# EAGLE design buzzer_breakout (EAGLE 6.5.0)
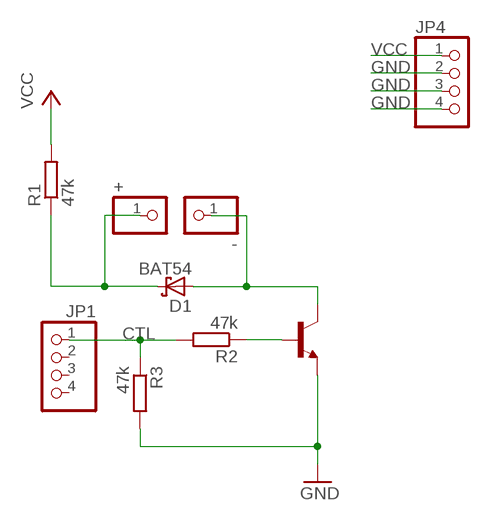
[diagram p0: schematic, sheet 1]

## Parts
+  PINHD-1X1  [1X01]
-  PINHD-1X1  [1X01]
D1  BAT54  [SOT23]
JP1  PINHD-1X4  [1X04]
JP4  PINHD-1X4  [1X04]
R1  47k  R-EU_R0805  [R0805]
R2  47k  R-EU_R0805  [R0805]
R3  47k  R-EU_R0805  [R0805]
T1  BC817-16-NPN-SOT23-BEC  [SOT23-BEC]

## Nets
CTL: JP1.1 R2.2 R3.1
GND: JP4.2 JP4.3 JP4.4 R3.2 T1.E
N$1: +.1 D1.3(C) R1.1
N$2: -.1 D1.1(A) T1.C
N$3: R2.1 T1.B
VCC: JP4.1 R1.2
Unconnected: JP1.2 JP1.3 JP1.4

## Library data of the parts
+ - = pinhead:PINHD-1X1: PIN HEADER
D1 = diode:BAT54: Schottky Diodes Source: Fairchild .. BAT54.pdf
JP1 JP4 = pinhead:PINHD-1X4: PIN HEADER
R1-R3 = resistor:R-EU_: RESISTOR, European symbol
T1 = transistor-neu-to92:*-NPN-: NPN Transistror

## Net classes
0 default: width 0.406 mm
1 Ground: width 0.1 mm, drill 0.2 mm

## Board
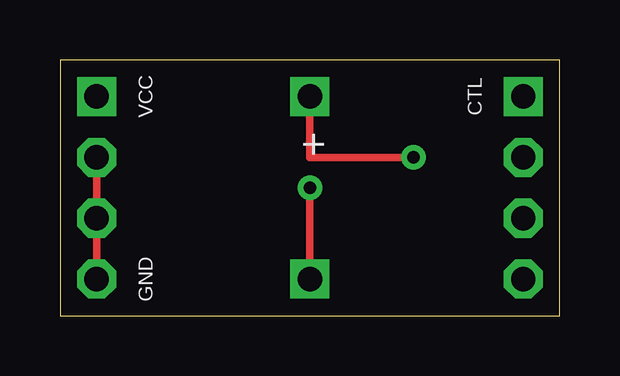
[diagram p1: board, top side]
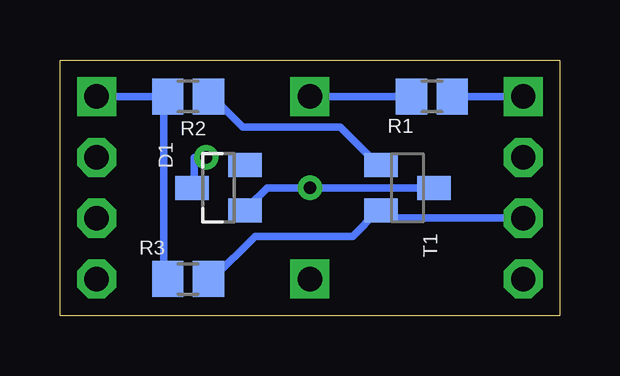
[diagram p2: board, bottom side, seen from below]

Size 20.83 x 10.67 mm. Coordinates in mm from the lower left corner, seen from the top.
Outline: 0,0 20.83,0 20.83,10.67 0,10.67 0,0
Copper layers (1*16): Top 0.035mm / dielectric 1.5mm / Bottom 0.035mm
Design rules "SparkFun *": minimum track width 10mil, minimum drill 20mil, track to track 8mil, track to pad 8mil, pad to pad 8mil, via to via 8mil, smd to smd 8mil, copper to edge 10mil, drill to drill 8mil, minimum pad ring 12mil, minimum via ring 10mil, stop-mask expansion 4mil, vias tented up to drill 25mil, thermal gap 10mil

### Footprints (pad centres in the part's own frame; a part is rotated, then mirrored left to right if it is on the bottom)
1X01 = drill 1.016 square: 1 0,0
SOT23 = smd 1 x 1.4: 1 -0.95,-1.1; 2 0.95,-1.1; 3 0,1.1
1X04 = drill 1.016 square: 1 -3.81,0 | drill 1.016 octagon: 2 -1.27,0; 3 1.27,0; 4 3.81,0
R0805 = smd 1.3 x 1.5: 1 -0.85,0; 2 0.85,0
SOT23-BEC = smd 1 x 1.4: B -0.95,-1.1; C 0,1.1; E 0.95,-1.1

### Placement (x,y rotation side)
+  10.41,9.14 0 top
-  10.41,1.52 0 top
D1  14.22,5.33 90 bottom
JP1  19.3,5.33 270 top
JP4  1.52,5.33 270 top
R1  5.33,9.14 0 bottom
R2  15.49,9.14 180 bottom
R3  15.49,1.52 0 bottom
T1  6.35,5.33 270 bottom

### Tracks (layer width: path | path; a pad name or v marks a point on that pad's centre or on a via)
CTL
  Bottom 0.305: 16.51,9.14 16.51,1.52 R3.1 | 16.51,9.14 JP1.1 | 16.51,9.14 R2.2
GND
  Top 0.305: JP4.4 JP4.3 JP4.2
  Bottom 0.305: JP4.3 7.11,4.06 7.37,4.32 T1.E 7.62,4.32 8.64,3.3 12.7,3.3 14.48,1.52 R3.2
N$1  (via drill 0.51)
  Top 0.305: v14.73,6.6 10.41,6.6 +.1
  Bottom 0.305: v14.73,6.6 15.24,6.6 15.24,5.33 D1.3 | +.1 R1.1
N$2  (via drill 0.51)
  Top 0.305: v10.41,5.33 -.1
  Bottom 0.305: T1.C v10.41,5.33 12.19,5.33 12.95,4.57 D1.1
N$3
  Bottom 0.305: T1.B 7.62,6.35 9.14,7.87 13.21,7.87 14.48,9.14 R2.1
VCC
  Bottom 0.305: JP4.1 R1.2

### Text on the board
tNames: VCC | CTL | GND